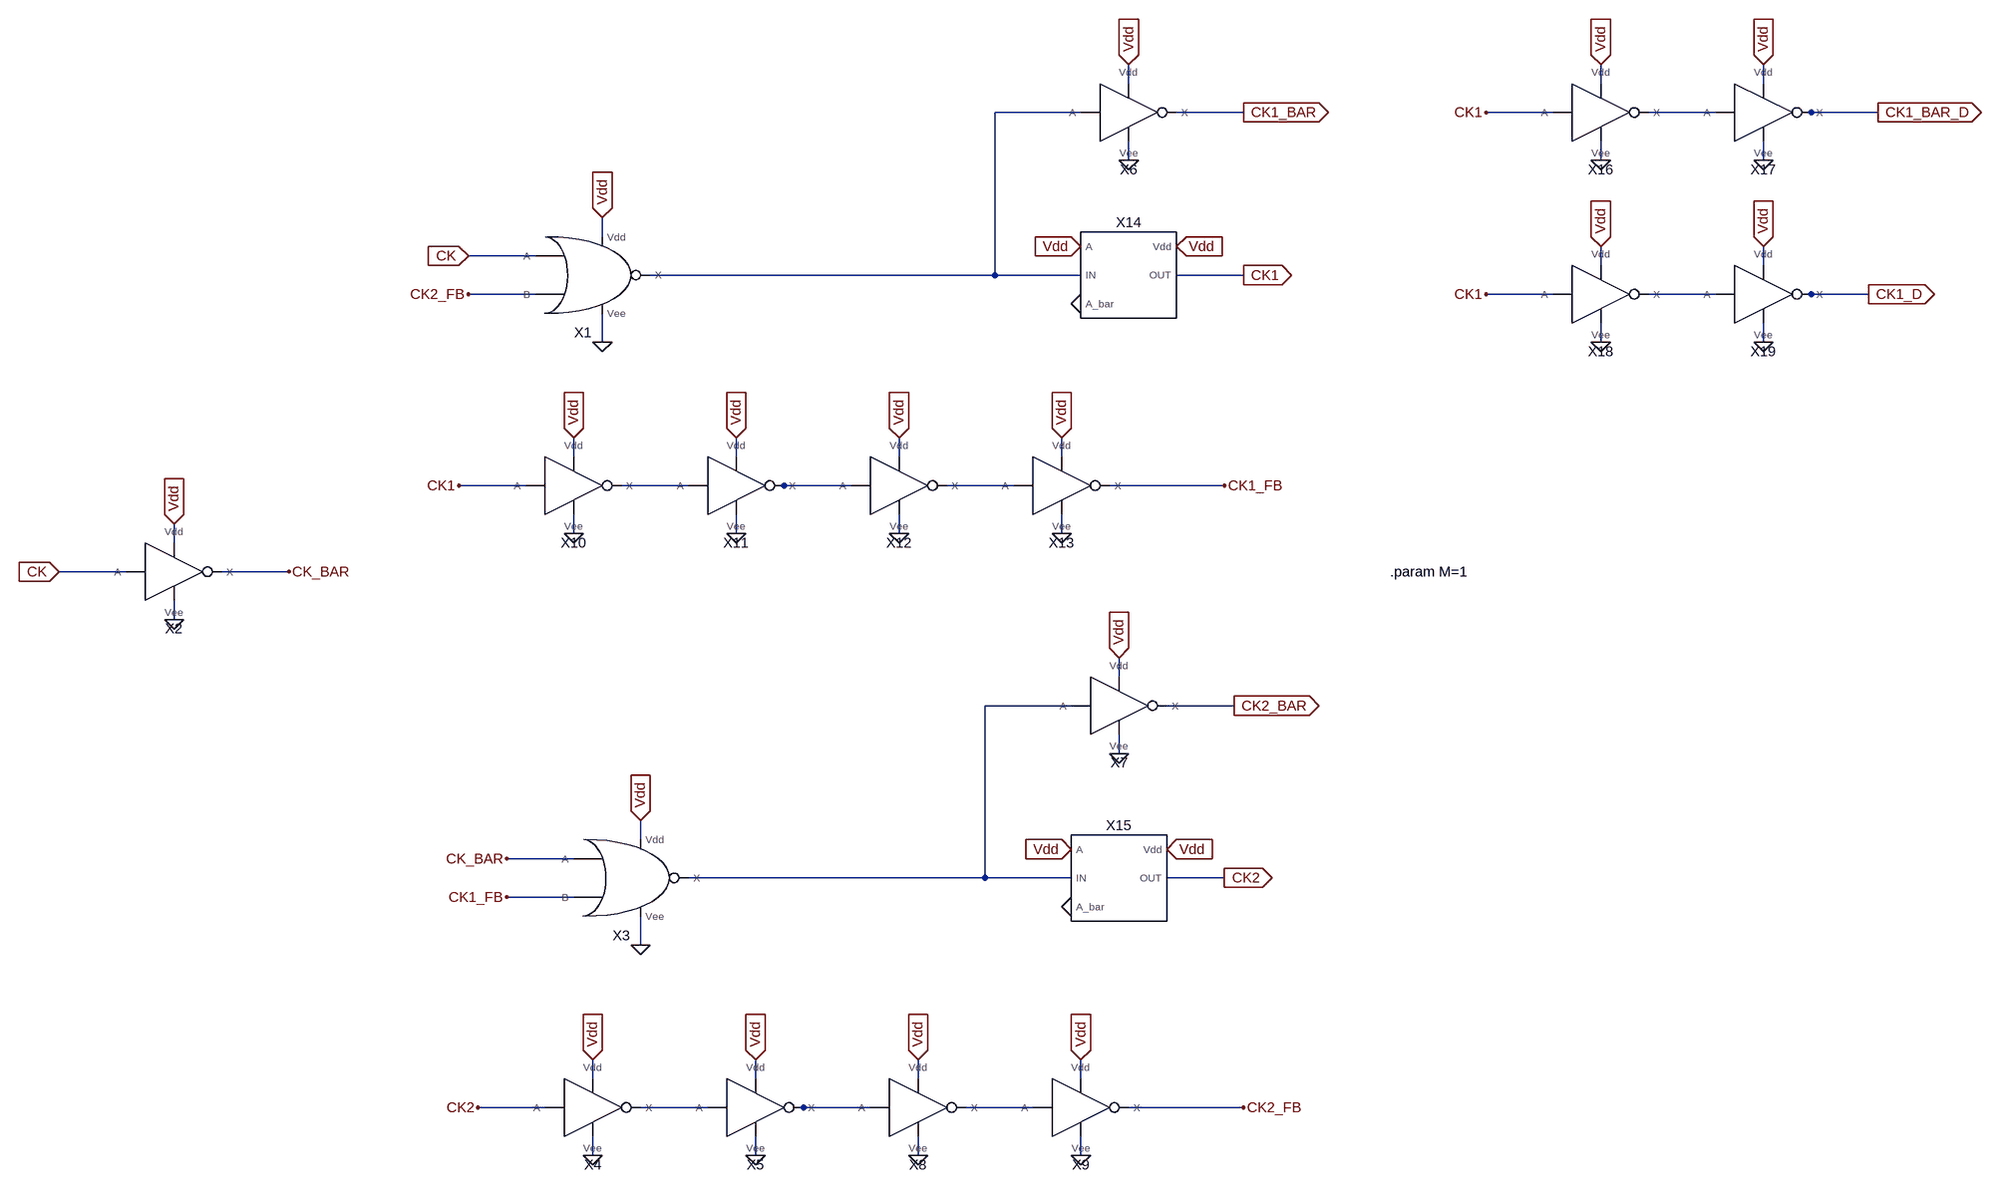
[diagram p0: schematic Draft6.asc]
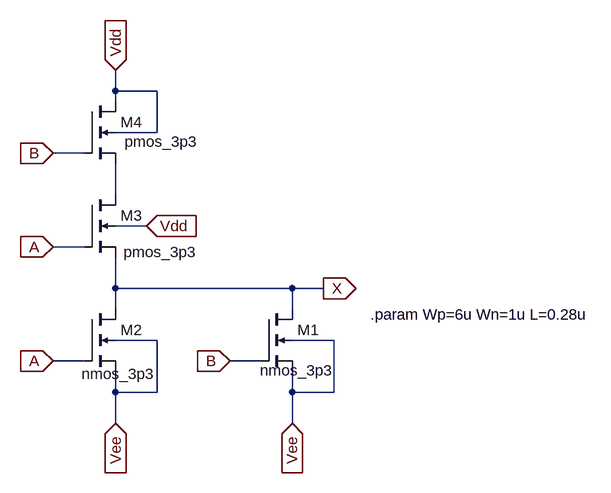
[diagram p1: sub-circuit nor2x1.asc]
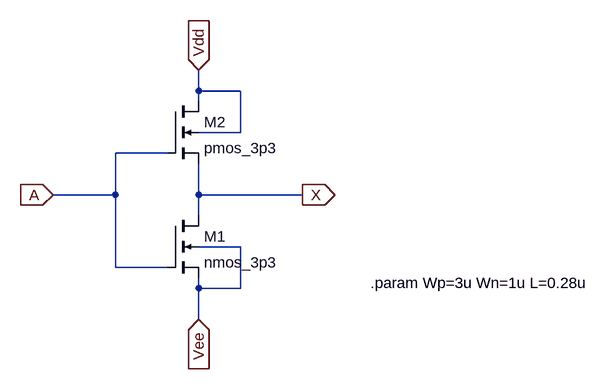
[diagram p2: sub-circuit invx1.asc]
Draft6.asc, the LTspice schematic file:
Version 4
SHEET 1 1944 816
WIRE 464 -1008 464 -1040
WIRE 1280 -1008 1280 -1040
WIRE 1552 -1008 1552 -1040
WIRE 384 -960 240 -960
WIRE 656 -960 544 -960
WIRE 1200 -960 1088 -960
WIRE 1472 -960 1360 -960
WIRE 1632 -960 1616 -960
WIRE 1744 -960 1632 -960
WIRE 464 -880 464 -912
WIRE 1280 -880 1280 -912
WIRE 1552 -880 1552 -912
WIRE -416 -752 -416 -784
WIRE -528 -720 -640 -720
WIRE 1280 -704 1280 -736
WIRE 1552 -704 1552 -736
WIRE 240 -688 240 -960
WIRE 240 -688 -336 -688
WIRE 384 -688 240 -688
WIRE 656 -688 544 -688
WIRE -528 -656 -640 -656
WIRE 1200 -656 1088 -656
WIRE 1472 -656 1360 -656
WIRE 1632 -656 1616 -656
WIRE 1728 -656 1632 -656
WIRE -416 -576 -416 -624
WIRE 1280 -576 1280 -608
WIRE 1552 -576 1552 -608
WIRE -464 -384 -464 -416
WIRE -192 -384 -192 -416
WIRE 80 -384 80 -416
WIRE 352 -384 352 -416
WIRE -544 -336 -656 -336
WIRE -272 -336 -384 -336
WIRE -112 -336 -128 -336
WIRE 0 -336 -112 -336
WIRE 272 -336 160 -336
WIRE 624 -336 432 -336
WIRE -464 -256 -464 -288
WIRE -192 -256 -192 -288
WIRE 80 -256 80 -288
WIRE 352 -256 352 -288
WIRE -1584 -240 -1584 -272
WIRE -1664 -192 -1776 -192
WIRE -1392 -192 -1504 -192
WIRE -1584 -112 -1584 -144
WIRE 448 -16 448 -48
WIRE 368 32 224 32
WIRE 640 32 528 32
WIRE 448 112 448 80
WIRE -352 256 -352 224
WIRE -464 288 -576 288
WIRE 224 320 224 32
WIRE 224 320 -272 320
WIRE 368 320 224 320
WIRE 624 320 528 320
WIRE -464 352 -576 352
WIRE -352 432 -352 384
WIRE -432 656 -432 624
WIRE -160 656 -160 624
WIRE 112 656 112 624
WIRE 384 656 384 624
WIRE -512 704 -624 704
WIRE -240 704 -352 704
WIRE -80 704 -96 704
WIRE 32 704 -80 704
WIRE 304 704 192 704
WIRE 656 704 464 704
WIRE -432 784 -432 752
WIRE -160 784 -160 752
WIRE 112 784 112 752
WIRE 384 784 384 752
FLAG -640 -720 CK
IOPIN -640 -720 In
FLAG -416 -576 0
FLAG -1776 -192 CK
IOPIN -1776 -192 In
FLAG -1392 -192 CK_BAR
FLAG -1584 -272 Vdd
IOPIN -1584 -272 In
FLAG -416 -784 Vdd
IOPIN -416 -784 In
FLAG -1584 -112 0
FLAG 656 -688 CK1
IOPIN 656 -688 Out
FLAG -576 288 CK_BAR
FLAG -352 432 0
FLAG -352 224 Vdd
IOPIN -352 224 In
FLAG -624 704 CK2
FLAG -432 624 Vdd
IOPIN -432 624 In
FLAG -432 784 0
FLAG -160 624 Vdd
IOPIN -160 624 In
FLAG -160 784 0
FLAG -576 352 CK1_FB
FLAG -640 -656 CK2_FB
FLAG 464 -1040 Vdd
IOPIN 464 -1040 In
FLAG 464 -880 0
FLAG 656 -960 CK1_BAR
IOPIN 656 -960 Out
FLAG 624 320 CK2
IOPIN 624 320 Out
FLAG 448 -48 Vdd
IOPIN 448 -48 In
FLAG 448 112 0
FLAG 656 704 CK2_FB
FLAG 112 624 Vdd
IOPIN 112 624 In
FLAG 112 784 0
FLAG 384 624 Vdd
IOPIN 384 624 In
FLAG 384 784 0
FLAG -656 -336 CK1
FLAG -464 -416 Vdd
IOPIN -464 -416 In
FLAG -464 -256 0
FLAG -192 -416 Vdd
IOPIN -192 -416 In
FLAG -192 -256 0
FLAG 624 -336 CK1_FB
FLAG 80 -416 Vdd
IOPIN 80 -416 In
FLAG 80 -256 0
FLAG 352 -416 Vdd
IOPIN 352 -416 In
FLAG 352 -256 0
FLAG 640 32 CK2_BAR
IOPIN 640 32 Out
FLAG 544 -736 Vdd
IOPIN 544 -736 In
FLAG 384 -736 Vdd
IOPIN 384 -736 In
FLAG 528 272 Vdd
IOPIN 528 272 In
FLAG 368 272 Vdd
IOPIN 368 272 In
FLAG 368 368 0
FLAG 384 -640 0
FLAG 1088 -960 CK1
FLAG 1280 -1040 Vdd
IOPIN 1280 -1040 In
FLAG 1280 -880 0
FLAG 1552 -1040 Vdd
IOPIN 1552 -1040 In
FLAG 1552 -880 0
FLAG 1088 -656 CK1
FLAG 1280 -736 Vdd
IOPIN 1280 -736 In
FLAG 1280 -576 0
FLAG 1552 -736 Vdd
IOPIN 1552 -736 In
FLAG 1552 -576 0
FLAG 1728 -656 CK1_D
IOPIN 1728 -656 Out
FLAG 1744 -960 CK1_BAR_D
IOPIN 1744 -960 Out
SYMBOL NOR2x1 -448 -688 R0
SYMATTR InstName X1
SYMBOL INVx1 -1584 -192 R0
SYMATTR InstName X2
SYMBOL NOR2x1 -384 320 R0
SYMATTR InstName X3
SYMBOL INVx1 -432 704 R0
SYMATTR InstName X4
SYMBOL INVx1 -160 704 R0
SYMATTR InstName X5
SYMBOL INVx1 464 -960 R0
SYMATTR InstName X6
SYMBOL INVx1 448 32 R0
SYMATTR InstName X7
SYMBOL INVx1 112 704 R0
SYMATTR InstName X8
SYMBOL INVx1 384 704 R0
SYMATTR InstName X9
SYMBOL INVx1 -464 -336 R0
SYMATTR InstName X10
SYMBOL INVx1 -192 -336 R0
SYMATTR InstName X11
SYMBOL INVx1 80 -336 R0
SYMATTR InstName X12
SYMBOL INVx1 352 -336 R0
SYMATTR InstName X13
SYMBOL tgate 464 -688 R0
SYMATTR InstName X14
SYMATTR SpiceLine L=0.28u Wn=1u Wp=3u M={M}
SYMBOL tgate 448 320 R0
SYMATTR InstName X15
SYMATTR SpiceLine L=0.28u Wn=1u Wp=3u M={M}
SYMBOL INVx1 1280 -960 R0
SYMATTR InstName X16
SYMBOL INVx1 1552 -960 R0
SYMATTR InstName X17
SYMBOL INVx1 1280 -656 R0
SYMATTR InstName X18
SYMBOL INVx1 1552 -656 R0
SYMATTR InstName X19
TEXT 928 -192 Left 2 !.param M=1

nor2x1.asc, the sub-circuit schematic file:
Version 4.1
SHEET 1 2956 680
WIRE 1680 -496 1680 -528
WIRE 1744 -496 1680 -496
WIRE 1680 -480 1680 -496
WIRE 1744 -432 1744 -496
WIRE 1744 -432 1680 -432
WIRE 1632 -400 1584 -400
WIRE 1680 -336 1680 -384
WIRE 1728 -288 1680 -288
WIRE 1632 -256 1584 -256
WIRE 1680 -192 1680 -240
WIRE 1952 -192 1680 -192
WIRE 2000 -192 1952 -192
WIRE 1680 -160 1680 -192
WIRE 1952 -160 1952 -192
WIRE 1744 -112 1680 -112
WIRE 2016 -112 1952 -112
WIRE 1632 -80 1584 -80
WIRE 1904 -80 1856 -80
WIRE 1680 -32 1680 -64
WIRE 1744 -32 1744 -112
WIRE 1744 -32 1680 -32
WIRE 1952 -32 1952 -64
WIRE 2016 -32 2016 -112
WIRE 2016 -32 1952 -32
WIRE 1680 16 1680 -32
WIRE 1952 16 1952 -32
FLAG 1584 -256 A
IOPIN 1584 -256 In
FLAG 2000 -192 X
IOPIN 2000 -192 Out
FLAG 1680 -528 Vdd
IOPIN 1680 -528 In
FLAG 1584 -80 A
IOPIN 1584 -80 In
FLAG 1856 -80 B
IOPIN 1856 -80 In
FLAG 1584 -400 B
IOPIN 1584 -400 In
FLAG 1952 16 Vee
IOPIN 1952 16 In
FLAG 1680 16 Vee
IOPIN 1680 16 In
FLAG 1728 -288 Vdd
IOPIN 1728 -288 In
SYMBOL nmos4 1904 -160 R0
WINDOW 3 -2 94 Left 2
SYMATTR Value nmos_3p3
SYMATTR InstName M1
SYMATTR Value2 l={L} w={Wn}
SYMBOL nmos4 1632 -336 R0
WINDOW 3 60 88 Left 2
SYMATTR Value pmos_3p3
SYMATTR InstName M3
SYMATTR Value2 l={L} w={Wp}
SYMBOL nmos4 1632 -480 R0
WINDOW 3 62 62 Left 2
SYMATTR Value pmos_3p3
SYMATTR InstName M4
SYMATTR Value2 l={L} w={Wp}
SYMBOL nmos4 1632 -160 R0
WINDOW 3 -4 100 Left 2
SYMATTR Value nmos_3p3
SYMATTR InstName M2
SYMATTR Value2 l={L} w={Wn}
TEXT 2072 -152 Left 2 !.param Wp=6u Wn=1u L=0.28u

invx1.asc, the sub-circuit schematic file:
Version 4.1
SHEET 1 2776 836
WIRE 416 -16 416 -48
WIRE 480 -16 416 -16
WIRE 416 0 416 -16
WIRE 480 48 480 -16
WIRE 480 48 416 48
WIRE 368 80 288 80
WIRE 288 144 288 80
WIRE 288 144 192 144
WIRE 416 144 416 96
WIRE 576 144 416 144
WIRE 416 176 416 144
WIRE 480 224 416 224
WIRE 288 256 288 144
WIRE 368 256 288 256
WIRE 416 288 416 272
WIRE 480 288 480 224
WIRE 480 288 416 288
WIRE 416 336 416 288
FLAG 416 -48 Vdd
IOPIN 416 -48 In
FLAG 192 144 A
IOPIN 192 144 In
FLAG 576 144 X
IOPIN 576 144 Out
FLAG 416 336 Vee
IOPIN 416 336 In
SYMBOL nmos4 368 176 R0
SYMATTR InstName M1
SYMATTR Value nmos_3p3
SYMATTR Value2 l={L} w={Wn}
SYMBOL nmos4 368 0 R0
SYMATTR InstName M2
SYMATTR Value pmos_3p3
SYMATTR Value2 l={L} w={Wp}
TEXT 680 280 Left 2 !.param Wp=3u Wn=1u L=0.28u

The netlist it stands for:
* Draft6.asc
XX1 CK CK2_FB Vdd 0 N001 nor2x1
XX2 CK Vdd CK_BAR 0 invx1
XX3 CK_BAR CK1_FB Vdd 0 N007 nor2x1
XX4 CK2 Vdd N008 0 invx1
XX5 N008 Vdd N009 0 invx1
XX6 N001 Vdd CK1_BAR 0 invx1
XX7 N007 Vdd CK2_BAR 0 invx1
XX8 N009 Vdd N010 0 invx1
XX9 N010 Vdd CK2_FB 0 invx1
XX10 CK1 Vdd N004 0 invx1
XX11 N004 Vdd N005 0 invx1
XX12 N005 Vdd N006 0 invx1
XX13 N006 Vdd CK1_FB 0 invx1
XX14 Vdd 0 N001 Vdd CK1 tgate L=0.28u Wn=1u Wp=3u M={M}  ; pins A A_bar IN Vdd OUT
XX15 Vdd 0 N007 Vdd CK2 tgate L=0.28u Wn=1u Wp=3u M={M}  ; pins A A_bar IN Vdd OUT
XX16 CK1 Vdd N002 0 invx1
XX17 N002 Vdd CK1_BAR_D 0 invx1
XX18 CK1 Vdd N003 0 invx1
XX19 N003 Vdd CK1_D 0 invx1

* block symbol definitions
.subckt nor2x1 A B Vdd Vee X
M1 X B Vee Vee nmos_3p3 l={L} w={Wn}
M3 N001 A X Vdd pmos_3p3 l={L} w={Wp}
M4 Vdd B N001 Vdd pmos_3p3 l={L} w={Wp}
M2 X A Vee Vee nmos_3p3 l={L} w={Wn}
.param Wp=6u Wn=1u L=0.28u
.ends nor2x1

.subckt invx1 A Vdd X Vee
M1 X A Vee Vee nmos_3p3 l={L} w={Wn}
M2 Vdd A X Vdd pmos_3p3 l={L} w={Wp}
.param Wp=3u Wn=1u L=0.28u
.ends invx1

.model NMOS NMOS
.model PMOS PMOS
.lib standard.mos
.param M=1
.backanno
.end